# Altium schematic sheet buttons_sch.SchDoc
size A
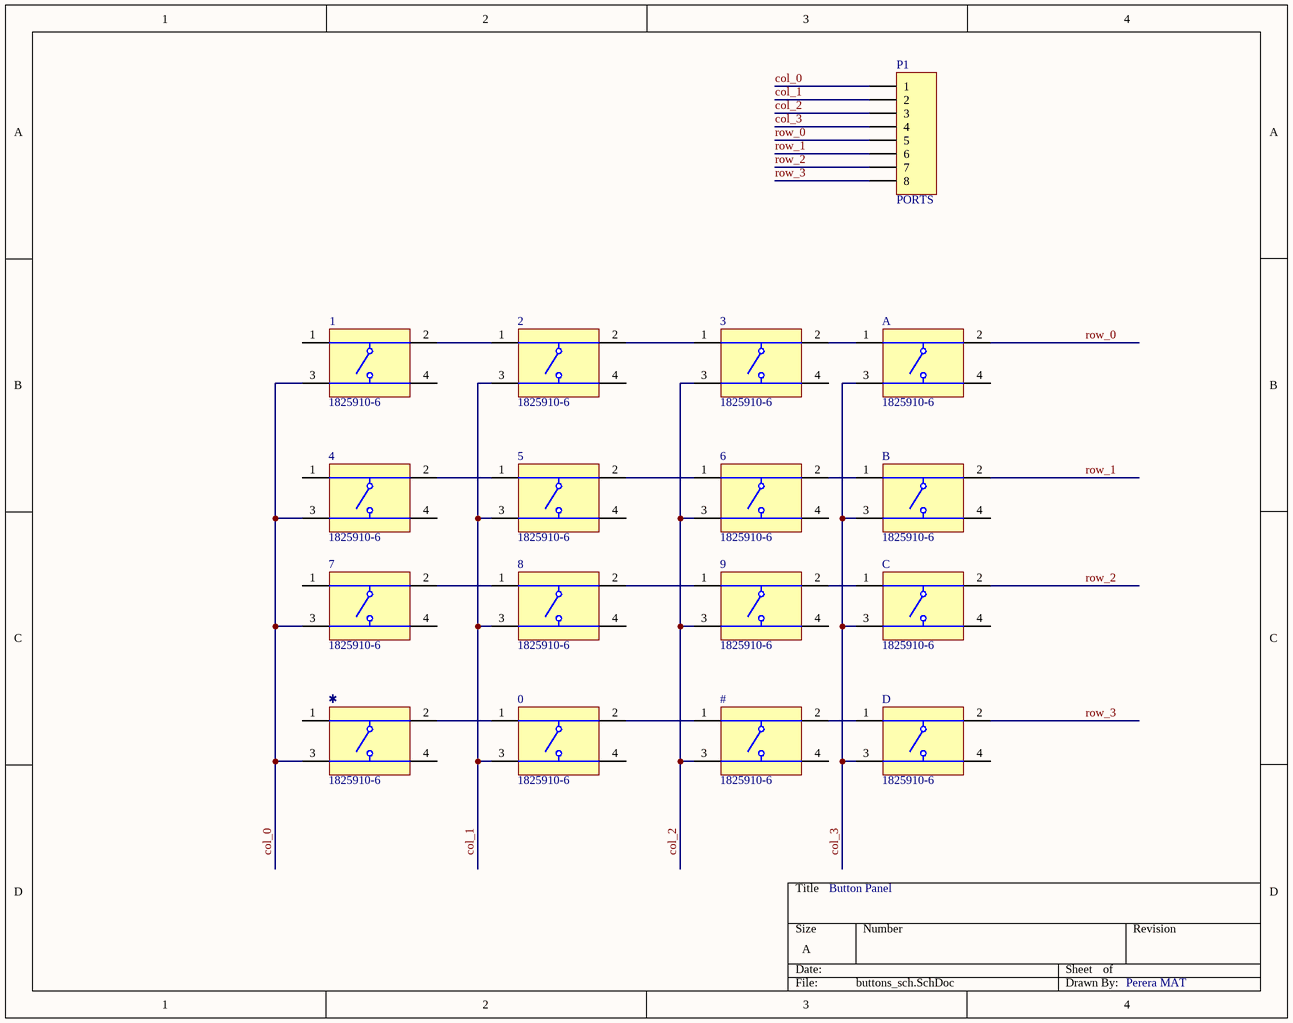
[diagram p0: buttons_sch.SchDoc]

## Parts
0  1825910-6  [TECO-1825910-6_V]
1  1825910-6  [TECO-1825910-6_V]
2  1825910-6  [TECO-1825910-6_V]
3  1825910-6  [TECO-1825910-6_V]
4  1825910-6  [TECO-1825910-6_V]
5  1825910-6  [TECO-1825910-6_V]
6  1825910-6  [TECO-1825910-6_V]
7  1825910-6  [TECO-1825910-6_V]
8  1825910-6  [TECO-1825910-6_V]
9  1825910-6  [TECO-1825910-6_V]
#  1825910-6  [TECO-1825910-6_V]
A  1825910-6  [TECO-1825910-6_V]
B  1825910-6  [TECO-1825910-6_V]
C  1825910-6  [TECO-1825910-6_V]
D  1825910-6  [TECO-1825910-6_V]
P1  PORTS  [HDR1X8]
✱  1825910-6  [TECO-1825910-6_V]

## Nets
col_0: 1.3 4.3 7.3 P1.1 ✱.3
col_1: 0.3 2.3 5.3 8.3 P1.2
col_2: 3.3 6.3 9.3 #.3 P1.3
col_3: A.3 B.3 C.3 D.3 P1.4
row_0: A.2 P1.5
row_1: B.2 P1.6
row_2: C.2 P1.7
row_3: D.2 P1.8
Net0_1: 0.1 ✱.2
Net0_2: 0.2 #.1
Net1_2: 1.2 2.1
Net2_2: 2.2 3.1
Net3_2: 3.2 A.1
Net4_2: 4.2 5.1
Net5_2: 5.2 6.1
Net6_2: 6.2 B.1
Net7_2: 7.2 8.1
Net8_2: 8.2 9.1
Net9_2: 9.2 C.1
Net#_2: #.2 D.1

Not connected (* = marked no-connect by the designer): 0 4; 1 1 4; 2 4; 3 4; 4 1 4; 5 4; 6 4; 7 1 4; 8 4; 9 4; # 4; A 4; B 4; C 4; D 4; ✱ 1 4

## Notes on the sheet
- Button Panel
- Perera MAT

## Library data of the parts
0-9 # A B C D ✱ = CMP-1684-00021-1: Tact Switch, SPST-NO, 0.05 A, -35 to 85 degC, 4-Pin THD, RoHS, Bulk; Manufacturer: TE Connectivity; Maximum Contact Resistance: 100mOhm; Mechanical Life: 100000Cycles; Bushing Type: Unthreaded; Switch Configuration: OFF(ON); Maximum DC Voltage Rating: 24V; Contact Rating @ Voltage: 0.05A@24VDC; Actuator Color: Black; Body Orientation: Straight; Function: MomentaryContact; Illumination: N/R; Actuator Style: RoundButton; Actuator Material: PolybutyleneTerephthalate; Dielectric Strength: 500VAC; Pole Throw Configuration: SPST; Actuator Length: 1.4mm; Product Weight: N/A; Contact Material: CopperAlloy; Housing Material: N/A; Terminal Type: PCPins; Minimum Insulation Resistance: 100MOhm; Package Description: 4-Pin Through Hole Device, Body 5.99 x 5.99 mm, Pitch 6.5 mm; Part No: 1825910-6; Package Reference: THD; Base Material: N/A; Manufacturer URL: http://www.te.com; Contact Plating: Silver; RoHS: Yes; Datasheet Version: Rev. C9; Electrical Life: 100000Cycles; Maximum AC Voltage Rating: N/A; Thread Size: N/R; Operating Temperature: -35to85C; Mounting: ThroughHole; Dimension: 5.99x5mm; Datasheet URL: http://www.te.com/commerce/DocumentDelivery/DDEController?Action=showdoc&DocId=Customer+Drawing%7F1825910%7FC9%7Fpdf%7FEnglish%7FENG_CD_1825910_C9.pdf%7F1825910-6; Family: 1825910; Seal Location: N/A; Seal Description: N/A; Packaging: N/A
P1 = Header 8: Header, 8-Pin; LatestRevisionDate: 17-Jul-2002; LatestRevisionNote: Re-released for DXP Platform.; Publisher: Altium Limited